# Altium schematic sheet 04-MCU.SchDoc: Microcontroller Unit, Sensors
size A3; DrawnBy: Rain Adelbert; Revision: 1.2; SheetNumber: 4; SheetTotal: 9
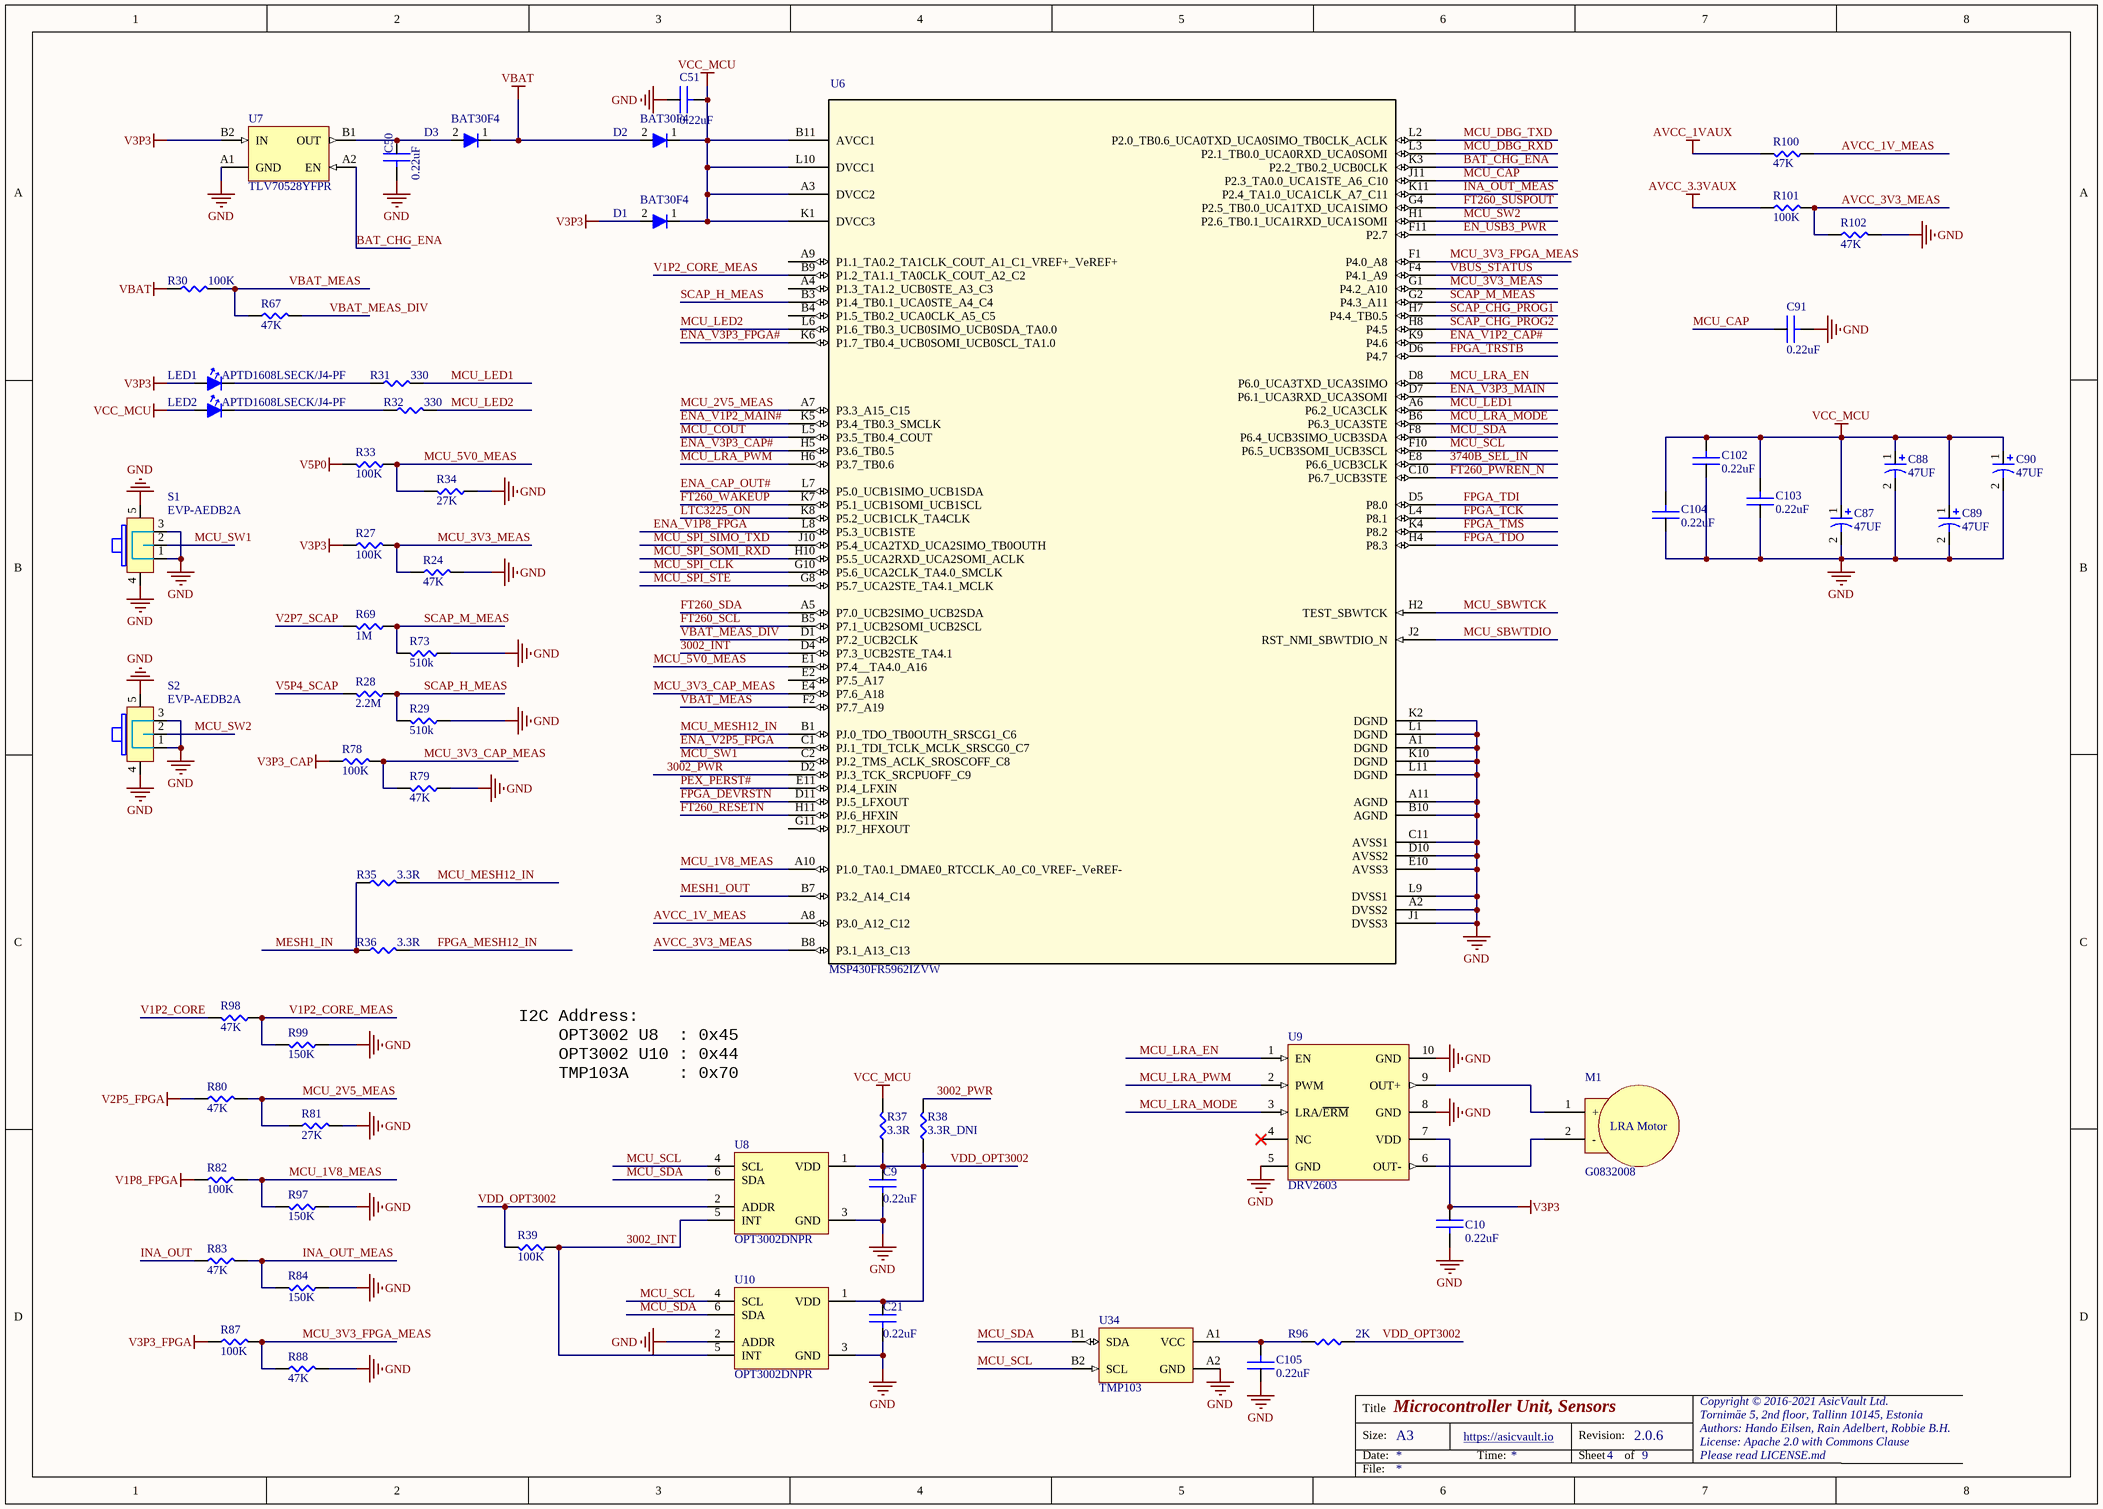
[diagram p0: 04-MCU.SchDoc]

## Parts
C9  0.22uF  [C0201]
C10  0.22uF  [C0201]
C21  0.22uF  [C0201]
C50  0.22uF  [C0201]
C51  0.22uF  [C0201]
C87  47UF  [M0603C]
C88  47UF  [M0603C]
C89  47UF  [M0603C]
C90  47UF  [M0603C]
C91  0.22uF  [C0201]
C102  0.22uF  [C0201]
C103  0.22uF  [C0201]
C104  0.22uF  [C0201]
C105  0.22uF  [C0201]
D1  BAT30F4  [D0201]
D2  BAT30F4  [D0201]
D3  BAT30F4  [D0201]
LED1  APTD1608LSECK/J4-PF  [LED0603]
LED2  APTD1608LSECK/J4-PF  [LED0603]
M1  G0832008  [G0832008]
R24  47K  [R0201]
R27  100K  [R0201]
R28  2.2M  [R0201]
R29  510k  [R0201]
R30  100K  [R0201]
R31  330  [R0201]
R32  330  [R0201]
R33  100K  [R0201]
R34  27K  [R0201]
R35  3.3R  [R0201]
R36  3.3R  [R0201]
R37  3.3R  [R0201]
R38  3.3R_DNI  [R0201]
R39  100K  [R0201]
R67  47K  [R0201]
R69  1M  [R0201]
R73  510k  [R0201]
R78  100K  [R0201]
R79  47K  [R0201]
R80  47K  [R0201]
R81  27K  [R0201]
R82  100K  [R0201]
R83  47K  [R0201]
R84  150K  [R0201]
R87  100K  [R0201]
R88  47K  [R0201]
R96  2K  [R0201]
R97  150K  [R0201]
R98  47K  [R0201]
R99  150K  [R0201]
R100  47K  [R0201]
R101  100K  [R0201]
R102  47K  [R0201]
S1  EVP-AEDB2A  [EVP-AEDB2A]
S2  EVP-AEDB2A  [EVP-AEDB2A]
U6  MSP430FR5962IZVW  [ZVW0087A]
U7  TLV70528YFPR  [DSBGA4]
U8  OPT3002DNPR  [USON6]
U9  DRV2603  [PWQFN-N10]
U10  OPT3002DNPR  [USON6]
U34  TMP103  [DSBGA4]

## Nets
AVCC_1VAUX: R100.2
AVCC_3.3VAUX: R101.1
GND: C9.2 C10.2 C21.2 C50.2 C51.1 C87.2 C88.2 C89.2 C90.2 C91.2 C102.1 C103.1 C104.1 C105.1 R24.2 R29.1 R34.1 R73.1 R79.1 R81.2 R84.1 R88.2 R97.1 R99.1 R102.2 S1.1(A1) S1.3(B1) S1.4(B2) S1.5(B2) S2.1(A1) S2.3(B1) S2.4(B2) S2.5(B2) U6.A1(DGND) U6.A2(DVSS2) U6.A11(AGND) U6.B10(AGND) U6.C11(AVSS1) U6.D10(AVSS2) U6.E10(AVSS3) U6.J1(DVSS3) U6.K2(DGND) U6.K10(DGND) U6.L1(DGND) U6.L9(DVSS1) U6.L11(DGND) U7.A1(GND) U8.3(GND) U9.5(GND) U9.8(GND) U9.10(GND) U10.2(ADDR) U10.3(GND) U34.A2(GND)
V1P8_FPGA: R82.1
V2P5_FPGA: R80.1
V3P3: C10.1 D1.2(A) LED1.2(A) R27.1 U7.B2(IN) U9.7(VDD)
V3P3_CAP: R78.1
V3P3_FPGA: R87.1
V5P0: R33.2
VBAT: D2.2(A) D3.1(K) R30.1
VCC_MCU: C51.2 C87.1 C88.1 C89.1 C90.1 C102.2 C103.2 C104.2 D1.1(K) D2.1(K) LED2.2(A) R37.2 U6.A3(DVCC2) U6.B11(AVCC1) U6.K1(DVCC3) U6.L10(DVCC1)
3002_INT: R39.1 U6.D4(P7.3_UCB2STE_TA4.1) U8.5(INT) U10.5(INT)
3002_PWR: R38.2 U6.D2(PJ.3_TCK_SRCPUOFF_C9)
3740B_SEL_IN: U6.E8(P6.6_UCB3CLK)
AVCC_1V_MEAS: R100.1 U6.A8(P3.0_A12_C12)
AVCC_3V3_MEAS: R101.2 R102.1 U6.B8(P3.1_A13_C13)
BAT_CHG_ENA: U6.K3(P2.2_TB0.2_UCB0CLK) U7.A2(EN)
EN_USB3_PWR: U6.F11(P2.7)
ENA_CAP_OUT#: U6.L7(P5.0_UCB1SIMO_UCB1SDA)
ENA_V1P2_CAP#: U6.K9(P4.6)
ENA_V1P2_MAIN#: U6.K5(P3.4_TB0.3_SMCLK)
ENA_V1P8_FPGA: U6.L8(P5.3_UCB1STE)
ENA_V2P5_FPGA: U6.C1(PJ.1_TDI_TCLK_MCLK_SRSCG0_C7)
ENA_V3P3_CAP#: U6.H5(P3.6_TB0.5)
ENA_V3P3_FPGA#: U6.K6(P1.7_TB0.4_UCB0SOMI_UCB0SCL_TA1.0)
ENA_V3P3_MAIN: U6.D7(P6.1_UCA3RXD_UCA3SOMI)
FPGA_DEVRSTN: U6.D11(PJ.5_LFXOUT)
FPGA_MESH12_IN: R36.2
FPGA_TCK: U6.L4(P8.1)
FPGA_TDI: U6.D5(P8.0)
FPGA_TDO: U6.H4(P8.3)
FPGA_TMS: U6.K4(P8.2)
FPGA_TRSTB: U6.D6(P4.7)
FT260_PWREN_N: U6.C10(P6.7_UCB3STE)
FT260_RESETN: U6.H11(PJ.6_HFXIN)
FT260_SCL: U6.B5(P7.1_UCB2SOMI_UCB2SCL)
FT260_SDA: U6.A5(P7.0_UCB2SIMO_UCB2SDA)
FT260_SUSPOUT: U6.G4(P2.5_TB0.0_UCA1TXD_UCA1SIMO)
FT260_WAKEUP: U6.K7(P5.1_UCB1SOMI_UCB1SCL)
INA_OUT: R83.1
INA_OUT_MEAS: R83.2 R84.2 U6.K11(P2.4_TA1.0_UCA1CLK_A7_C11)
LTC3225_ON: U6.K8(P5.2_UCB1CLK_TA4CLK)
MCU_1V8_MEAS: R82.2 R97.2 U6.A10(P1.0_TA0.1_DMAE0_RTCCLK_A0_C0_VREF-_VeREF-)
MCU_2V5_MEAS: R80.2 R81.1 U6.A7(P3.3_A15_C15)
MCU_3V3_CAP_MEAS: R78.2 R79.2 U6.E4(P7.6_A18)
MCU_3V3_FPGA_MEAS: R87.2 R88.1 U6.F1(P4.0_A8)
MCU_3V3_MEAS: R24.1 R27.2 U6.G1(P4.2_A10)
MCU_5V0_MEAS: R33.1 R34.2 U6.E1(P7.4__TA4.0_A16)
MCU_CAP: C91.1 U6.J11(P2.3_TA0.0_UCA1STE_A6_C10)
MCU_COUT: U6.L5(P3.5_TB0.4_COUT)
MCU_DBG_RXD: U6.L3(P2.1_TB0.0_UCA0RXD_UCA0SOMI)
MCU_DBG_TXD: U6.L2(P2.0_TB0.6_UCA0TXD_UCA0SIMO_TB0CLK_ACLK)
MCU_LED1: R31.2 U6.A6(P6.2_UCA3CLK)
MCU_LED2: R32.2 U6.L6(P1.6_TB0.3_UCB0SIMO_UCB0SDA_TA0.0)
MCU_LRA_EN: U6.D8(P6.0_UCA3TXD_UCA3SIMO) U9.1(EN)
MCU_LRA_MODE: U6.B6(P6.3_UCA3STE) U9.3(LRA/~{ERM})
MCU_LRA_PWM: U6.H6(P3.7_TB0.6) U9.2(PWM)
MCU_MESH12_IN: R35.2 U6.B1(PJ.0_TDO_TB0OUTH_SRSCG1_C6)
MCU_SBWTCK: U6.H2(TEST_SBWTCK)
MCU_SBWTDIO: U6.J2(RST_NMI_SBWTDIO_N)
MCU_SCL: U6.F10(P6.5_UCB3SOMI_UCB3SCL) U8.4(SCL) U10.4(SCL) U34.B2(SCL)
MCU_SDA: U6.F8(P6.4_UCB3SIMO_UCB3SDA) U8.6(SDA) U10.6(SDA) U34.B1(SDA)
MCU_SPI_CLK: U6.G10(P5.6_UCA2CLK_TA4.0_SMCLK)
MCU_SPI_SIMO_TXD: U6.J10(P5.4_UCA2TXD_UCA2SIMO_TB0OUTH)
MCU_SPI_SOMI_RXD: U6.H10(P5.5_UCA2RXD_UCA2SOMI_ACLK)
MCU_SPI_STE: U6.G8(P5.7_UCA2STE_TA4.1_MCLK)
MCU_SW1: S1.2(A2) U6.C2(PJ.2_TMS_ACLK_SROSCOFF_C8)
MCU_SW2: S2.2(A2) U6.H1(P2.6_TB0.1_UCA1RXD_UCA1SOMI)
MESH1_IN: R35.1 R36.1
MESH1_OUT: U6.B7(P3.2_A14_C14)
PEX_PERST#: U6.E11(PJ.4_LFXIN)
SCAP_CHG_PROG1: U6.H7(P4.4_TB0.5)
SCAP_CHG_PROG2: U6.H8(P4.5)
SCAP_H_MEAS: R28.1 R29.2 U6.B3(P1.4_TB0.1_UCA0STE_A4_C4)
SCAP_M_MEAS: R69.1 R73.2 U6.G2(P4.3_A11)
V1P2_CORE: R98.2
V1P2_CORE_MEAS: R98.1 R99.2 U6.B9(P1.2_TA1.1_TA0CLK_COUT_A2_C2)
V2P7_SCAP: R69.2
V5P4_SCAP: R28.2
VBAT_MEAS: R30.2 R67.1 U6.F2(P7.7_A19)
VBAT_MEAS_DIV: R67.2 U6.D1(P7.2_UCB2CLK)
VBUS_STATUS: U6.F4(P4.1_A9)
VDD_OPT3002: C9.1 C21.1 R37.1 R38.1 R39.2 R96.1 U8.1(VDD) U8.2(ADDR) U10.1(VDD)
NetC50_1: C50.1 D3.2(A) U7.B1(OUT)
NetC105_2: C105.2 R96.2 U34.A1(VCC)
NetLED1_1: LED1.1(K) R31.1
NetLED2_1: LED2.1(K) R32.1
NetM1_1: M1.1(+) U9.9(OUT+)
NetM1_2: M1.2(-) U9.6(OUT-)

Not connected (* = marked no-connect by the designer): U6 A4(P1.3_TA1.2_UCB0STE_A3_C3) A9(P1.1_TA0.2_TA1CLK_COUT_A1_C1_VREF+_VeREF+) B4(P1.5_TB0.2_UCA0CLK_A5_C5) E2(P7.5_A17) G11(PJ.7_HFXOUT); U9 4(NC)*

## Notes on the sheet
- I2C Address:
  OPT3002 U8  : 0x45
  OPT3002 U10 : 0x44
  TMP103A     : 0x70
- Title
- Size:
- Date:
- A3
- https://asicvault.io
- Time:
- Revision:
- Sheet
- of
- 2.0.6
- Copyright © 2016-2021 AsicVault Ltd.
- Tornimäe 5, 2nd floor, Tallinn 10145, Estonia
- Authors: Hando Eilsen, Rain Adelbert, Robbie B.H.
- License: Apache 2.0 with Commons Clause
- Please read LICENSE.md
- File:
- (in symbol G0832008) LRA Motor

## Library data of the parts
C9 C10 C21 C50 C51 C91 C102-C105 = 0.22uF/0201: Description 1: CAP CER 0.22UF 6.3V X7S 0201; Supplier Part Number 1: 445-9075-1-ND; Supplier 1: Digi-Key
C87-C90 = 47UF/4V: Description 1: CAP TANT 47UF 4V 20% 0603; Supplier 1: Digi-Key; Supplier Part Number 1: 478-8635-1-ND
D1-D3 = BAT30F4: Description 1: DIODE SCHOTTKY 30V 300MA 0201; Supplier 1: Digi-Key; Supplier Part Number 1: 497-15253-1-ND
LED1 LED2 = LED_ORGN_0603_KB: Description 1: LED ORANGE CLEAR 0603 SMD; Supplier 1: Digi-Key; Supplier Part Number 1: 754-1946-1-ND
M1 = G0832008: AC Motor Vibration, LRA 1.8VAC; Description 1: AC Motor Vibration, LRA 1.8VAC; Supplier 1: Digi-Key; Supplier Part Number 1: 1670-1032-ND
R24 R67 R79 R80 R83 R88 R98 R100 R102 = 47K/1%/0201: Description 1: RES SMD 47K OHM 1% 1/20W 0201; Supplier 1: Digi-Key; Supplier Part Number 1: 311-47KMCT-ND
R27 R30 R33 R39 R78 R82 R87 R101 = 100K/1%/0201: Description 1: RES SMD 100K OHM 1% 1/20W 0201; Supplier 1: Digi-Key; Supplier Part Number 1: 311-100KMCT-ND
R28 = 2M2/1%/0201: Description 1: RES SMD 2.2M OHM 1% 1/20W 0201; Supplier 1: Mouser; Supplier Part Number 1: 603-RC0201FR-072M2L
R29 R73 = 510K/1%/0201: Description 1: RES SMD 510K OHM 1% 1/20W 0201; Supplier 1: Mouser; Supplier Part Number 1: 603-RC0201FR-07510KL
R31 R32 = 330/1%/0201: Description 1: RES SMD 330 OHM 1% 1/20W 0201; Supplier 1: Digi-Key; Supplier Part Number 1: YAG2604CT-ND
R34 R81 = 27K/1%/0201: Description 1: RES SMD 27K OHM 1% 1/20W 0201; Supplier 1: Digi-Key; Supplier Part Number 1: P27.0KABCT-ND
R35-R38 = 3.3R/1%/0201: Description 1: RES SMD 3.3 OHM 1% 1/20W 0201; Supplier 1: Digi-Key; Supplier Part Number 1: AC0201FR-073R3L-ND
R69 = 1M/1%/0201: Description 1: RES SMD 1M OHM 1% 1/20W 0201; Supplier 1: Digi-Key; Supplier Part Number 1: 311-1MMCT-ND
R84 R97 R99 = 150K/1%/0201: Description 1: RES SMD 150K OHM 1% 1/20W 0201; Supplier 1: Digi-Key; Supplier Part Number 1: YAG2272CT-ND
R96 = 2K/1%/0201: Description 1: RES SMD 2K OHM 1% 1/20W 0201; Supplier 1: Digi-Key; Supplier Part Number 1: YAG2280CT-ND
S1 S2 = EVP-AEDB2A: Description 1: SWITCH TACTILE SPST-NO 0.02A 15V; Supplier 1: Digi-Key; Supplier Part Number 1: P15509CT-ND
U6 = MSP430FR5962IZVW: Description 1: IC MCU 16BIT 128KB FRAM 87NFBGA; Supplier Part Number 1: MSP430FR5962IZVWR; Supplier 1: Digikey
U7 = TLV70528YFPR: 200mA LDO, DSBGA; Description 1: IC REG LDO 2.8V 0.2A DSBGA; Supplier 1: Mouser; Supplier Part Number 1: 595-TLV70528YFPR
U8 U10 = OPT3002DNPR: Description 1: IC PHOTOSENSOR AMBIENT 6CHIPLED; Supplier 1: Digi-Key; Supplier Part Number 1: 296-44600-1-ND
U9 = DRV2603: Haptic Drive for ERM and LRA; Description 1: Haptic Driver for ERM and LRA; Supplier 1: Mouser; Supplier Part Number 1: 595-DRV2603RUNR
U34 = TMP103AYFFR: SMBus Digital Temperature Sensor; Supplier 1: Mouser; Supplier Part Number 1: 595-TMP103AYFFR; Description 1: SMBus Digital Temperature Sensor